# Altium project 32旋转LED主控板子.PrjPcb
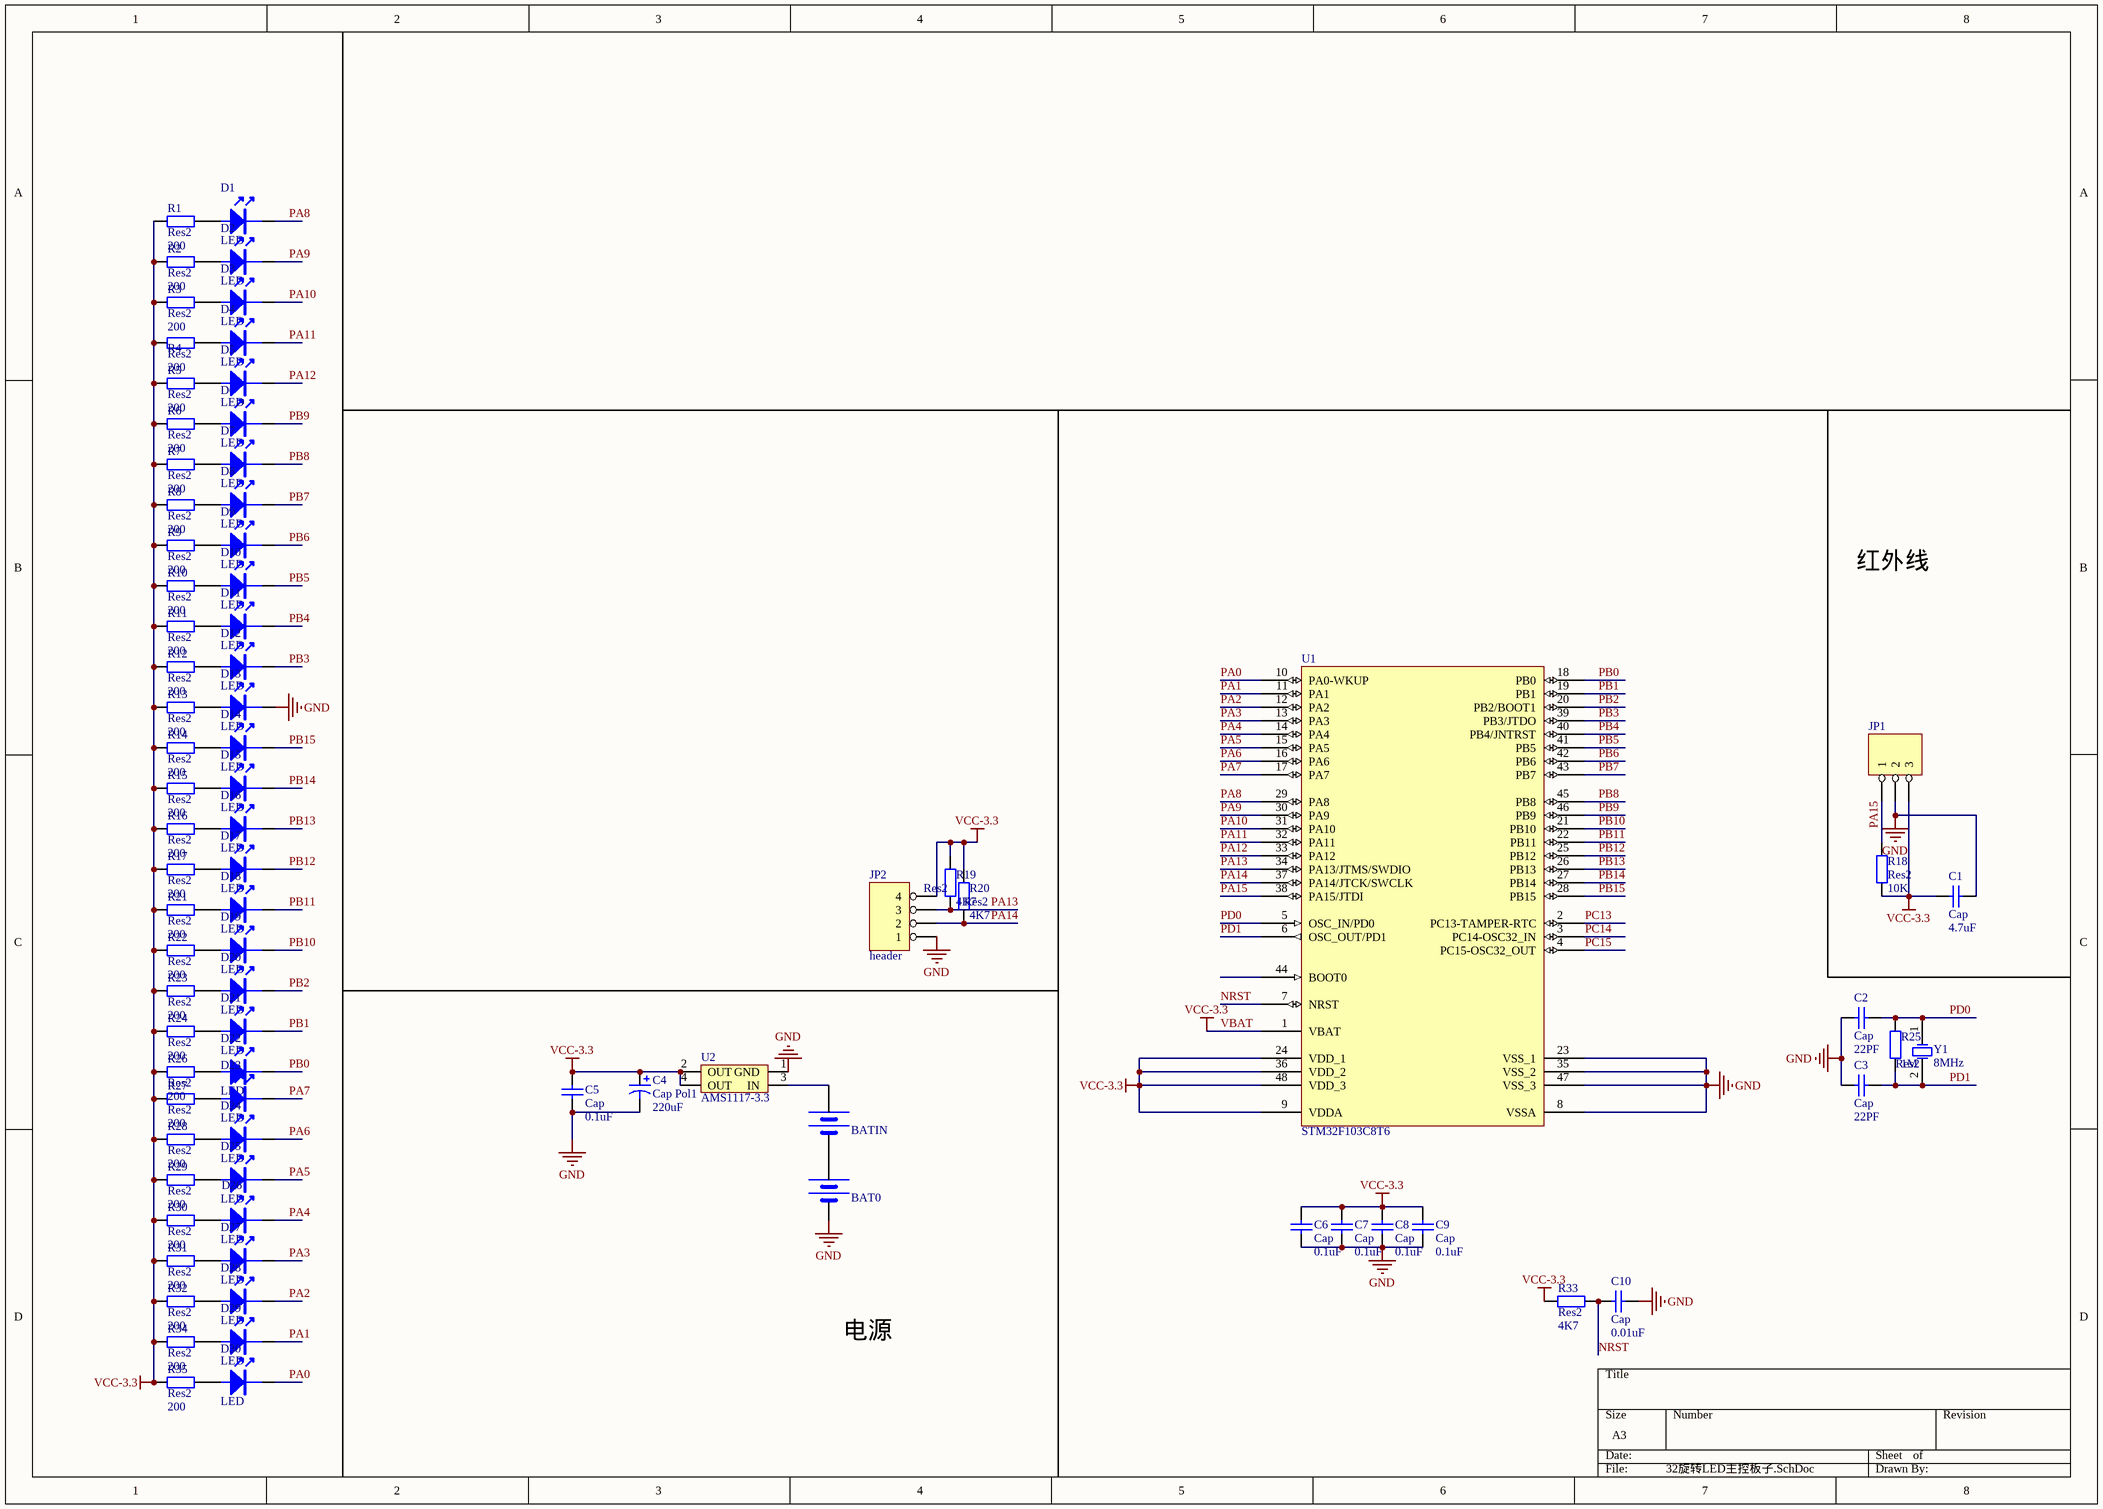
[diagram p0: 32旋转LED主控板子.SchDoc]
1 sheet, 82 parts. Net scope: global (net labels, ports and power ports of the same name join across sheets).
Board file: 32旋转LED主控板子.PcbDoc

## Sheet 32旋转LED主控板子.SchDoc
size A3

### Parts
BAT0  BATT  [BATM]  (value not drawn)
BATIN  BATT  [BATM]  (value not drawn)
C1  Cap  value 4.7uF  [0805_C]
C2  Cap  value 22PF  [0805_C]
C3  Cap  value 22PF  [0805_C]
C4  Cap Pol1  value 220uF  [10UF]
C5  Cap  value 0.1uF  [0805_C]
C6  Cap  value 0.1uF  [0805_C]
C7  Cap  value 0.1uF  [0805_C]
C8  Cap  value 0.1uF  [0805_C]
C9  Cap  value 0.1uF  [0805_C]
C10  Cap  value 0.01uF  [0805_C]
D1  LED  [0805_LED]
D2  LED  [0805_LED]
D3  LED  [0805_LED]
D4  LED  [0805_LED]
D5  LED  [0805_LED]
D6  LED  [0805_LED]
D7  LED  [0805_LED]
D8  LED  [0805_LED]
D9  LED  [0805_LED]
D10  LED  [0805_LED]
D11  LED  [0805_LED]
D12  LED  [0805_LED]
D13  LED  [0805_LED]
D14  LED  [0805_LED]
D15  LED  [0805_LED]
D16  LED  [0805_LED]
D17  LED  [0805_LED]
D18  LED  [0805_LED]
D19  LED  [0805_LED]
D20  LED  [0805_LED]
D21  LED  [0805_LED]
D22  LED  [0805_LED]
D23  LED  [0805_LED]
D24  LED  [0805_LED]
D25  LED  [0805_LED]
D26  LED  [0805_LED]
D27  LED  [0805_LED]
D28  LED  [0805_LED]
D29  LED  [0805_LED]
D30  LED  [0805_LED]
JP1  header  [header3]  (value not drawn)
JP2  header  [header4]
R1  Res2  value 200  [0805_R]
R2  Res2  value 200  [0805_R]
R3  Res2  value 200  [0805_R]
R4  Res2  value 200  [0805_R]
R5  Res2  value 200  [0805_R]
R6  Res2  value 200  [0805_R]
R7  Res2  value 200  [0805_R]
R8  Res2  value 200  [0805_R]
R9  Res2  value 200  [0805_R]
R10  Res2  value 200  [0805_R]
R11  Res2  value 200  [0805_R]
R12  Res2  value 200  [0805_R]
R13  Res2  value 200  [0805_R]
R14  Res2  value 200  [0805_R]
R15  Res2  value 200  [0805_R]
R16  Res2  value 200  [0805_R]
R17  Res2  value 200  [0805_R]
R18  Res2  value 10K  [0805_R]
R19  Res2  value 4K7  [0805_R]
R20  Res2  value 4K7  [0805_R]
R21  Res2  value 200  [0805_R]
R22  Res2  value 200  [0805_R]
R23  Res2  value 200  [0805_R]
R24  Res2  value 200  [0805_R]
R25  Res2  value 1M  [0805_R]
R26  Res2  value 200  [0805_R]
R27  Res2  value 200  [0805_R]
R28  Res2  value 200  [0805_R]
R29  Res2  value 200  [0805_R]
R30  Res2  value 200  [0805_R]
R31  Res2  value 200  [0805_R]
R32  Res2  value 200  [0805_R]
R33  Res2  value 4K7  [0805_R]
R34  Res2  value 200  [0805_R]
R35  Res2  value 200  [0805_R]
U1  STM32F103C8T6  [LQFP48]
U2  AMS1117-3.3  [AMS1117]
Y1  8MHz  [XTAL_2]

### Nets
GND: BAT0.2(GND) C1.2 C2.1 C3.1 C4.2 C5.1 C6.1 C7.1 C8.1 C9.1 C10.2 D13.2(K) JP1.2 JP2.1 U1.8(VSSA) U1.23(VSS_1) U1.35(VSS_2) U1.47(VSS_3) U2.1(GND)
VBAT: C1.1 C4.1 C5.2 C6.2 C7.2 C8.2 C9.2 JP1.3 JP2.4 R1.2 R2.2 R3.2 R4.2 R5.2 R6.2 R7.2 R8.2 R9.2 R10.2 R11.2 R12.2 R13.2 R14.2 R15.2 R16.2 R17.2 R18.1 R19.2 R20.2 R21.2 R22.2 R23.2 R24.2 R26.2 R27.2 R28.2 R29.2 R30.2 R31.2 R32.2 R33.1 R34.2 R35.2 U1.1(VBAT) U1.9(VDDA) U1.24(VDD_1) U1.36(VDD_2) U1.48(VDD_3) U2.2(OUT) U2.4(OUT)  [also labelled VCC-3.3]
NRST: C10.1 R33.2 U1.7(NRST)
PA0: D30.2(K) U1.10(PA0-WKUP)
PA1: D29.2(K) U1.11(PA1)
PA2: D28.2(K) U1.12(PA2)
PA3: D27.2(K) U1.13(PA3)
PA4: D26.2(K) U1.14(PA4)
PA5: D25.2(K) U1.15(PA5)
PA6: D24.2(K) U1.16(PA6)
PA7: D23.2(K) U1.17(PA7)
PA8: D1.2(K) U1.29(PA8)
PA9: D2.2(K) U1.30(PA9)
PA10: D3.2(K) U1.31(PA10)
PA11: D4.2(K) U1.32(PA11)
PA12: D5.2(K) U1.33(PA12)
PA13: JP2.3 R19.1 U1.34(PA13/JTMS/SWDIO)
PA14: JP2.2 R20.1 U1.37(PA14/JTCK/SWCLK)
PA15: JP1.1 R18.2 U1.38(PA15/JTDI)
PB0: D22.2(K) U1.18(PB0)
PB1: D21.2(K) U1.19(PB1)
PB2: D20.2(K) U1.20(PB2/BOOT1)
PB3: D12.2(K) U1.39(PB3/JTDO)
PB4: D11.2(K) U1.40(PB4/JNTRST)
PB5: D10.2(K) U1.41(PB5)
PB6: D9.2(K) U1.42(PB6)
PB7: D8.2(K) U1.43(PB7)
PB8: D7.2(K) U1.45(PB8)
PB9: D6.2(K) U1.46(PB9)
PB10: D19.2(K) U1.21(PB10)
PB11: D18.2(K) U1.22(PB11)
PB12: D17.2(K) U1.25(PB12)
PB13: D16.2(K) U1.26(PB13)
PB14: D15.2(K) U1.27(PB14)
PB15: D14.2(K) U1.28(PB15)
PC13: U1.2(PC13-TAMPER-RTC)
PC14: U1.3(PC14-OSC32_IN)
PC15: U1.4(PC15-OSC32_OUT)
PD0: C2.2 R25.2 U1.5(OSC_IN/PD0) Y1.1(OSC1)
PD1: C3.2 R25.1 U1.6(OSC_OUT/PD1) Y1.2(OSC2)
NetBAT0_1: BAT0.1(VCC) BATIN.2(GND)
NetBATIN_1: BATIN.1(VCC) U2.3(IN)
NetD1_1: D1.1(A) R1.1
NetD2_1: D2.1(A) R2.1
NetD3_1: D3.1(A) R3.1
NetD4_1: D4.1(A) R4.1
NetD5_1: D5.1(A) R5.1
NetD6_1: D6.1(A) R6.1
NetD7_1: D7.1(A) R7.1
NetD8_1: D8.1(A) R8.1
NetD9_1: D9.1(A) R9.1
NetD10_1: D10.1(A) R10.1
NetD11_1: D11.1(A) R11.1
NetD12_1: D12.1(A) R12.1
NetD13_1: D13.1(A) R13.1
NetD14_1: D14.1(A) R14.1
NetD15_1: D15.1(A) R15.1
NetD16_1: D16.1(A) R16.1
NetD17_1: D17.1(A) R17.1
NetD18_1: D18.1(A) R21.1
NetD19_1: D19.1(A) R22.1
NetD20_1: D20.1(A) R23.1
NetD21_1: D21.1(A) R24.1
NetD22_1: D22.1(A) R26.1
NetD23_1: D23.1(A) R27.1
NetD24_1: D24.1(A) R28.1
NetD25_1: D25.1(A) R29.1
NetD26_1: D26.1(A) R30.1
NetD27_1: D27.1(A) R31.1
NetD28_1: D28.1(A) R32.1
NetD29_1: D29.1(A) R34.1
NetD30_1: D30.1(A) R35.1

Not connected (* = marked no-connect by the designer): U1 44(BOOT0)

### Notes on the sheet
- 红外线
- 电源

### Library data of the parts
BAT0 BATIN = BAT
C1-C3 C5-C10 = Cap: Capacitor; Published: 8-Jun-2000; LatestRevisionDate: 17-Jul-2002; LatestRevisionNote: Re-released for DXP Platform.; PackageReference: RAD-0.3; Publisher: Altium Limited; PackageDescription: Radial Cap, Thru-Hole; 2 Leads; 0.3 in Pin Spacing
C4 = Cap Pol1: Polarized Capacitor (Radial); Published: 8-Jun-2000; LatestRevisionDate: 17-Jul-2002; LatestRevisionNote: Re-released for DXP Platform.; PackageReference: RB7.6-15; Publisher: Altium Limited; PackageDescription: Polarized Capacitor (Radial); 2 Leads
D1-D30 = LED: LED 发光二极管
JP1 = HEADER 3
JP2 = HEADER 4
R1-R35 = Res2: Resistor; Published: 8-Jun-2000; LatestRevisionDate: 17-Jul-2002; LatestRevisionNote: Re-released for DXP Platform.; PackageReference: AXIAL-0.4; Publisher: Altium Limited; PackageDescription: Axial Device, Thru-Hole; 2 Leads; 0.4 in Pin Spacing
U1 = STM32F103C8T6: STM32 ARM-based 32-bit MCU with 64 Kbytes Flash, 48-pin LQFP, Industrial Temperature; Published: 30-May-2008; DatasheetVersion: rev6, Mar-2008; PackageVersion: Mar-2008; PackageReference: LQFP48; Publisher: Altium Limited; PackageDescription: 48-Pin Low-Profile Quad Flat Pack, 7 x 7 mm Body, 0.5 mm Pitch (LQFP48); ComponentLink1Description: Manufacturer Link; ComponentLink1URL: www.st.com/stm32; ComponentLink2Description: Datasheet; ComponentLink2URL: http://www.st.com/stonline/products/literature/ds/13587.pdf
U2 = AMS1117
Y1 = XTAL: Crystal Oscillator; Published: 8-Jun-2000; LatestRevisionDate: 17-Jul-2002; LatestRevisionNote: Re-released for DXP Platform.; Publisher: Altium Limited